# Altium project CLARA Mainboard.PrjPcb
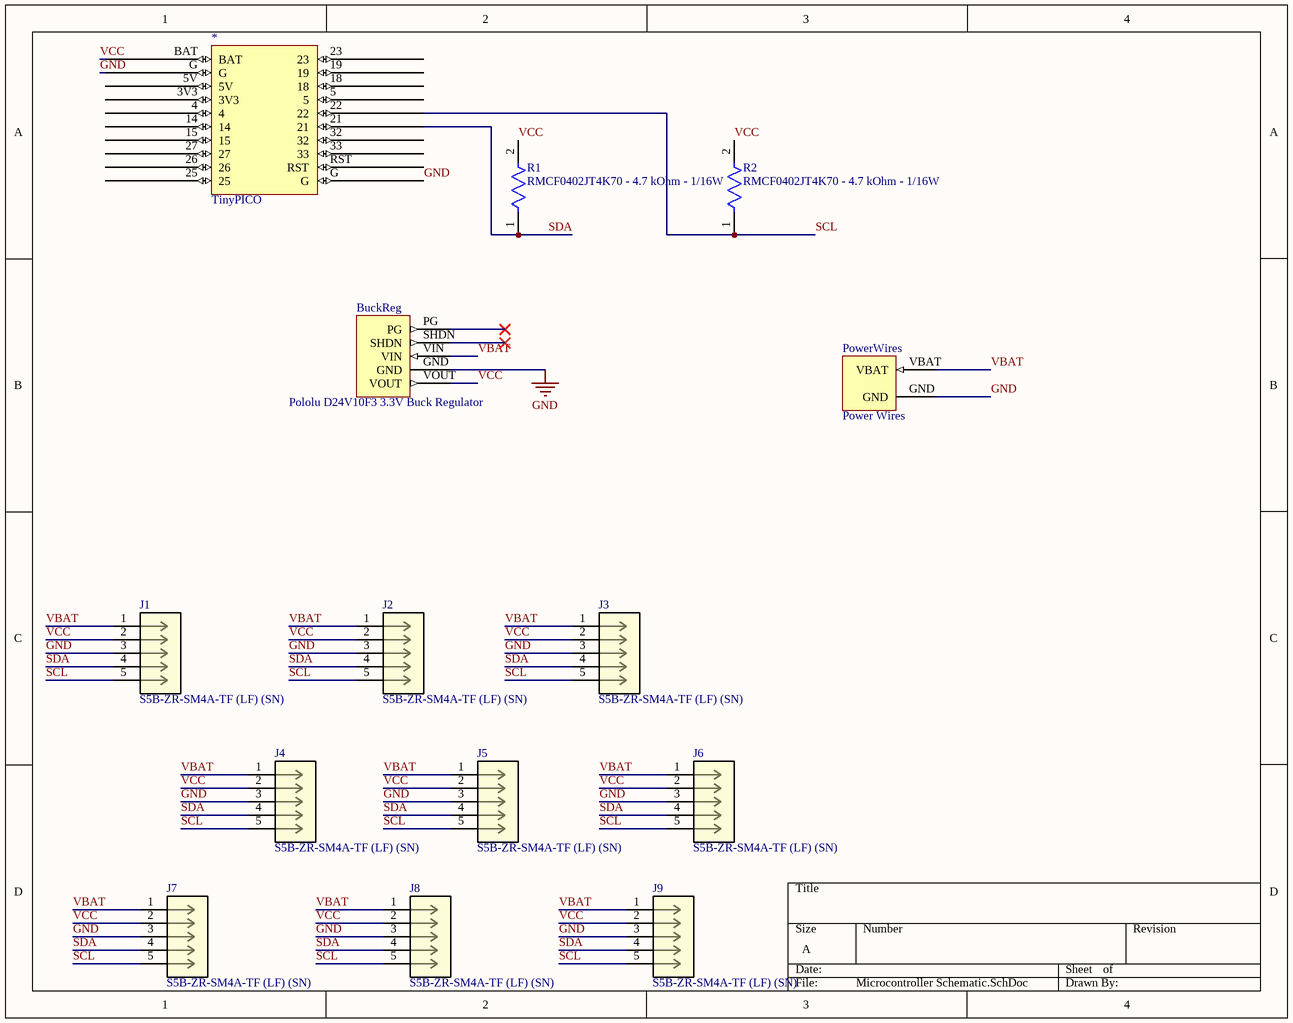
[diagram p0: Microcontroller Schematic.SchDoc]
1 sheet, 14 parts. Net scope: global (net labels, ports and power ports of the same name join across sheets).
Board file: CLARA_Mainboard.PcbDoc

## Sheet Microcontroller Schematic.SchDoc
size A; SheetNumber: 1; SheetTotal: 1

### Parts
*  TinyPICO  [TinyPICO Board]
BuckReg  Pololu D24V10F3 3.3V Buck Regulator  [PCBComponent_1]
J1  S5B-ZR-SM4A-TF (LF) (SN)  [CONN_S5B-ZR-SM4A-TF_JST]
J2  S5B-ZR-SM4A-TF (LF) (SN)  [CONN_S5B-ZR-SM4A-TF_JST]
J3  S5B-ZR-SM4A-TF (LF) (SN)  [CONN_S5B-ZR-SM4A-TF_JST]
J4  S5B-ZR-SM4A-TF (LF) (SN)  [CONN_S5B-ZR-SM4A-TF_JST]
J5  S5B-ZR-SM4A-TF (LF) (SN)  [CONN_S5B-ZR-SM4A-TF_JST]
J6  S5B-ZR-SM4A-TF (LF) (SN)  [CONN_S5B-ZR-SM4A-TF_JST]
J7  S5B-ZR-SM4A-TF (LF) (SN)  [CONN_S5B-ZR-SM4A-TF_JST]
J8  S5B-ZR-SM4A-TF (LF) (SN)  [CONN_S5B-ZR-SM4A-TF_JST]
J9  S5B-ZR-SM4A-TF (LF) (SN)  [CONN_S5B-ZR-SM4A-TF_JST]
PowerWires  Power Wires  [Power Wires]
R1  RMCF0402JT4K70 - 4.7 kOhm - 1/16W  [FP-RMCF0402-MFG]
R2  RMCF0402JT4K70 - 4.7 kOhm - 1/16W  [FP-RMCF0402-MFG]

### Nets
GND: *.G BuckReg.GND J1.3 J2.3 J3.3 J4.3 J5.3 J6.3 J7.3 J8.3 J9.3 PowerWires.GND
SCL: *.22 J1.5 J2.5 J3.5 J4.5 J5.5 J6.5 J7.5 J8.5 J9.5 R2.1
SDA: *.21 J1.4 J2.4 J3.4 J4.4 J5.4 J6.4 J7.4 J8.4 J9.4 R1.1
VBAT: BuckReg.VIN J1.1 J2.1 J3.1 J4.1 J5.1 J6.1 J7.1 J8.1 J9.1 PowerWires.VBAT
VCC: *.BAT BuckReg.VOUT J1.2 J2.2 J3.2 J4.2 J5.2 J6.2 J7.2 J8.2 J9.2 R1.2 R2.2

Not connected (* = marked no-connect by the designer): * 3V3 4 5 5V 14 15 18 19 23 25 26 27 32 33 RST; BuckReg PG* SHDN*

### Library data of the parts
BuckReg PowerWires = Component_1
J1-J9 = S5B-ZR-SM4A-TF (LF) (SN): No Description Available; Mfr_Name: JST; Copyright: Copyright (C) 2021 Ultra Librarian. All rights reserved.; Manufacturer_Part_Number: S5B-ZR-SM4A-TF (LF) (SN); RefDes: RefDes; Type: DEV
R1 R2 = CMP-2000-06988-2: 4.7kΩ ±5% 0.063W 0402 Thick Film Chip Resistor AEC-Q200 compliant; Resistance: 4.7kR; Power Rating: 63mW; Temperature Coefficient: 100ppm/°C; Case Code (Metric): 1005; Features: Automotive AEC-Q200; Length: 0.039inch; Width: 0.02inch; Min Operating Temperature: -55°C; Depth: 0.5mm; Tolerance: 5%; Contact Plating: Tin; Military Standard: Not; Number of Terminations: 2; Height: 0.016inch; Radiation Hardening: No; Packaging: Tape and Reel; RoHS Compliant: Yes; Max Power Dissipation: 63mW; Case Code (Imperial): 0402; Resistor Type: Thick Film; Series: RMCF; Max Operating Temperature: 155°C; Mount: Surface Mount; Case/Package: 0402; Construction: Rectangular; Lead Free: Lead Free